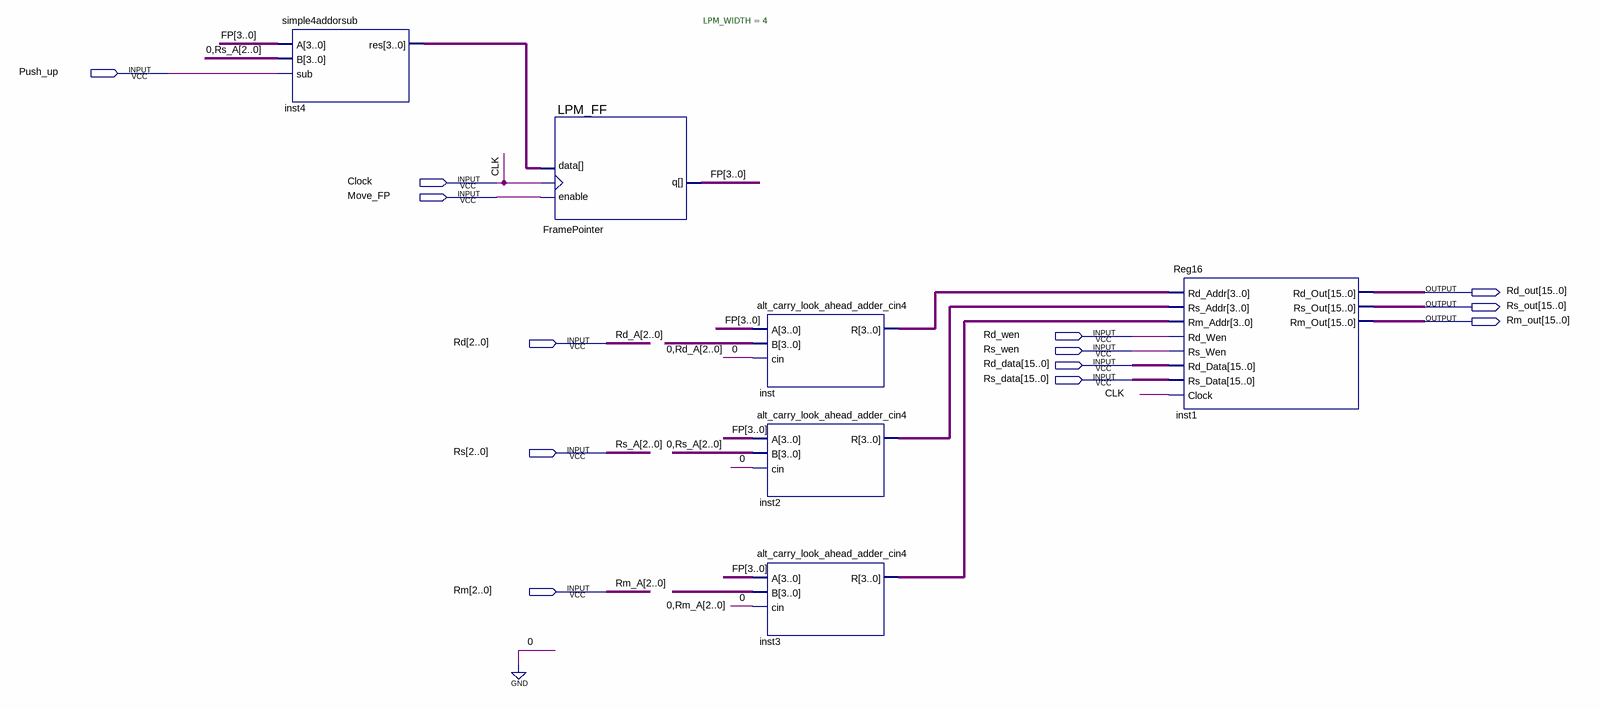
[diagram p0: schematic sheet]
// Quartus schematic RegisterStackLite.bdf as structural Verilog: 6 symbols, 13 pins
module RegisterStackLite (
  input  Push_up,
  input  Clock,
  input  Move_FP,
  input  Rd_wen,
  input  [2:0] Rd,
  input  Rs_wen,
  input  [15:0] Rd_data,
  input  [15:0] Rs_data,
  input  [2:0] Rs,
  input  [2:0] Rm,
  output [15:0] Rd_out,
  output [15:0] Rs_out,
  output [15:0] Rm_out
);

  wire [3:0] FP, inst2_r, inst3_r, inst4_res, inst_r;

  simple4addorsub inst4 (.A(FP), .B({1'b0, Rs}), .sub(Push_up), .res(inst4_res));
  LPM_FF #(.LPM_WIDTH(4)) FramePointer (.enable(Move_FP), .clock(Clock), .data(inst4_res), .q(FP));
  alt_carry_look_ahead_adder_cin4 inst (.A(FP), .B({1'b0, Rd}), .cin(1'b0), .R(inst_r));
  alt_carry_look_ahead_adder_cin4 inst2 (.A(FP), .B({1'b0, Rs}), .cin(1'b0), .R(inst2_r));
  alt_carry_look_ahead_adder_cin4 inst3 (.A(FP), .B({1'b0, Rm}), .cin(1'b0), .R(inst3_r));
  Reg16 inst1 (
    .Rd_Addr(inst_r), .Rs_Addr(inst2_r), .Rm_Addr(inst3_r), .Rd_Wen(Rd_wen), .Rs_Wen(Rs_wen),
    .Rd_Data(Rd_data), .Rs_Data(Rs_data), .Clock(Clock), .Rd_Out(Rd_out), .Rs_Out(Rs_out), .Rm_Out(Rm_out));

  // Other names for the same wires on the sheet: CLK = Clock; Rd_A[2:0] = Rd; Rm_A[2:0] = Rm; Rs_A[2:0] = Rs
endmodule
